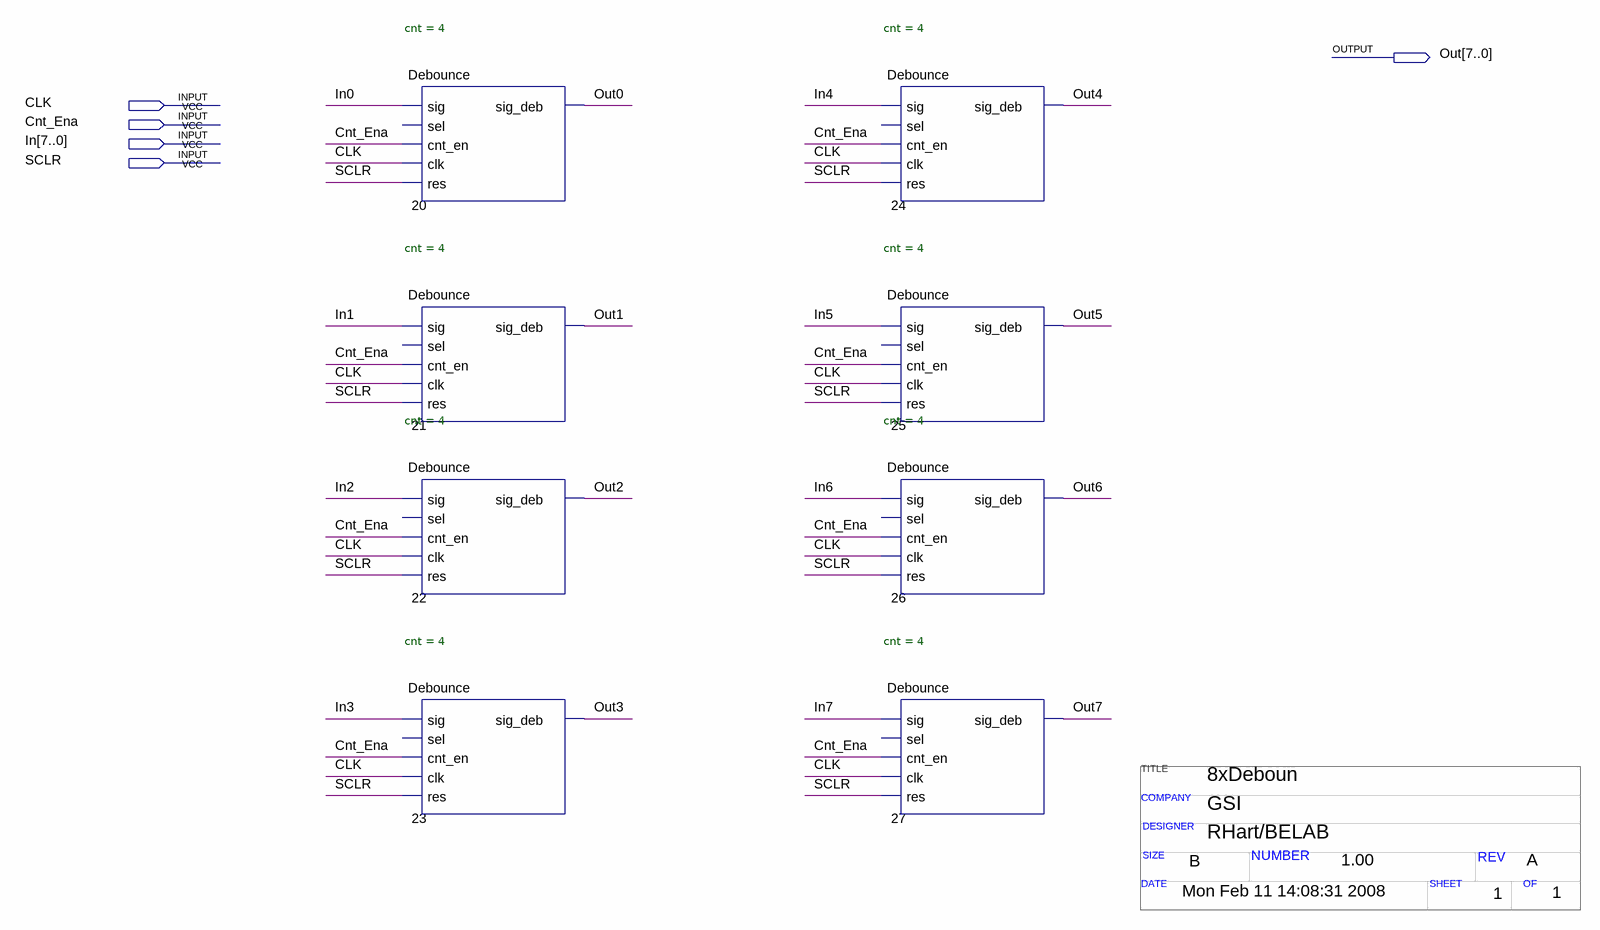
[diagram p0: schematic sheet]
// Quartus schematic 8xdeboun.bdf as structural Verilog: 8 symbols, 5 pins
// Title block: TITLE: 8xDeboun; COMPANY: GSI; DESIGNER: RHart/BELAB; SIZE: B; NUMBER: 1.00; REV: A; DATE: Mon Feb 11 14:08:31 2008; SHEET: 1; OF: 1
module \8xdeboun  (
  input  CLK,
  input  Cnt_Ena,
  input  [7:0] In,
  input  SCLR,
  output [7:0] Out
);

  Debounce #(.cnt(4)) u_20 (.sig(In[0]), .cnt_en(Cnt_Ena), .clk(CLK), .res(SCLR), .sig_deb(Out[0]));  // open: sel
  Debounce #(.cnt(4)) u_21 (.sig(In[1]), .cnt_en(Cnt_Ena), .clk(CLK), .res(SCLR), .sig_deb(Out[1]));  // open: sel
  Debounce #(.cnt(4)) u_22 (.sig(In[2]), .cnt_en(Cnt_Ena), .clk(CLK), .res(SCLR), .sig_deb(Out[2]));  // open: sel
  Debounce #(.cnt(4)) u_23 (.sig(In[3]), .cnt_en(Cnt_Ena), .clk(CLK), .res(SCLR), .sig_deb(Out[3]));  // open: sel
  Debounce #(.cnt(4)) u_24 (.sig(In[4]), .cnt_en(Cnt_Ena), .clk(CLK), .res(SCLR), .sig_deb(Out[4]));  // open: sel
  Debounce #(.cnt(4)) u_25 (.sig(In[5]), .cnt_en(Cnt_Ena), .clk(CLK), .res(SCLR), .sig_deb(Out[5]));  // open: sel
  Debounce #(.cnt(4)) u_26 (.sig(In[6]), .cnt_en(Cnt_Ena), .clk(CLK), .res(SCLR), .sig_deb(Out[6]));  // open: sel
  Debounce #(.cnt(4)) u_27 (.sig(In[7]), .cnt_en(Cnt_Ena), .clk(CLK), .res(SCLR), .sig_deb(Out[7]));  // open: sel
endmodule
